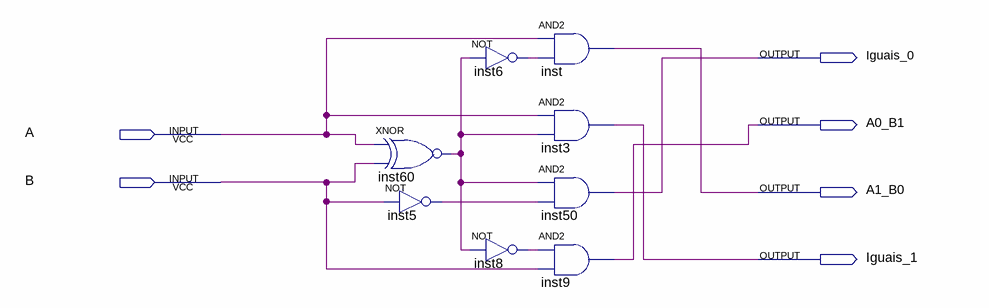
[diagram p0: schematic sheet]
// Quartus schematic comparadorSinal.bdf as structural Verilog: 8 symbols, 6 pins
module comparadorSinal (
  input  A,
  input  B,
  output Iguais_0,
  output A0_B1,
  output A1_B0,
  output Iguais_1
);

  wire inst5_out, inst6_out, inst8_out, inst60_out;

  xnor inst60 (inst60_out, A, B);
  not inst5 (inst5_out, B);
  not inst6 (inst6_out, inst60_out);
  not inst8 (inst8_out, inst60_out);
  and inst (A1_B0, A, inst6_out);
  and inst3 (Iguais_1, A, inst60_out);
  and inst50 (Iguais_0, inst60_out, inst5_out);
  and inst9 (A0_B1, inst8_out, B);
endmodule
